# Altium schematic sheet Net.SchDoc
size A4
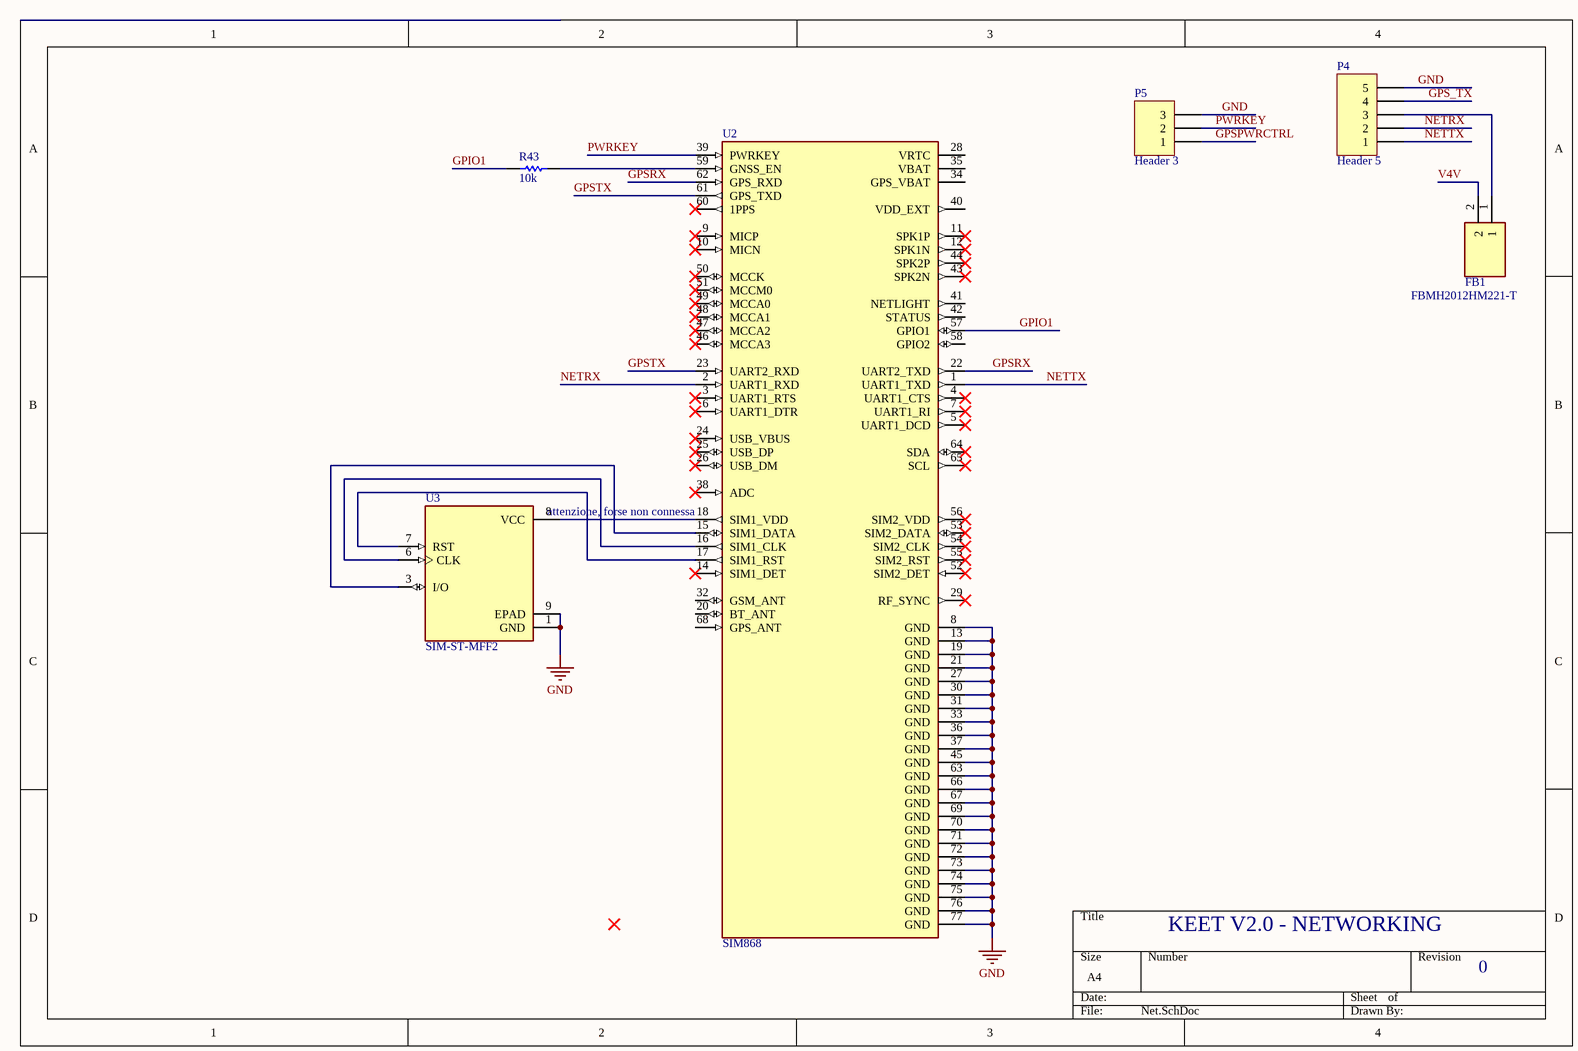
[diagram p0: Net.SchDoc]

## Parts
FB1  FBMH2012HM221-T  [BEADC2012X105N]
P4  Header 5  [HDR1X5]
P5  Header 3  [HDR1X3]
R43  10k  [RESC1005X04N]
U2  SIM868  [XCVR_SIM868]
U3  SIM-ST-MFF2  [PSON127P500X600X82-9N]

## Nets
GND: P4.5 P5.3 U2.8(GND) U2.13(GND) U2.19(GND) U2.21(GND) U2.27(GND) U2.30(GND) U2.31(GND) U2.33(GND) U2.36(GND) U2.37(GND) U2.45(GND) U2.63(GND) U2.66(GND) U2.67(GND) U2.69(GND) U2.70(GND) U2.71(GND) U2.72(GND) U2.73(GND) U2.74(GND) U2.75(GND) U2.76(GND) U2.77(GND) U3.1(GND) U3.9(EPAD)
GPIO1: R43.2 U2.57(GPIO1)
GPS_TX: P4.4
GPSPWRCTRL: P5.1
GPSRX: U2.22(UART2_TXD) U2.62(GPS_RXD)
GPSTX: U2.23(UART2_RXD) U2.61(GPS_TXD)
NETRX: P4.2 U2.2(UART1_RXD)
NETTX: P4.1 U2.1(UART1_TXD)
PWRKEY: P5.2 U2.39(PWRKEY)
V4V: FB1.2
NetFB1_1: FB1.1 P4.3
NetR43_1: R43.1 U2.59(GNSS_EN)
NetU2_15: U2.15(SIM1_DATA) U3.3(I/O)
NetU2_16: U2.16(SIM1_CLK) U3.6(CLK)
NetU2_17: U2.17(SIM1_RST) U3.7(RST)
NetU2_18: U2.18(SIM1_VDD) U3.8(VCC)

Not connected (* = marked no-connect by the designer): U2 3(UART1_RTS)* 4(UART1_CTS)* 5(UART1_DCD)* 6(UART1_DTR)* 7(UART1_RI)* 9(MICP)* 10(MICN)* 11(SPK1P)* 12(SPK1N)* 14(SIM1_DET)* 20(BT_ANT) 24(USB_VBUS)* 25(USB_DP)* 26(USB_DM)* 28(VRTC) 29(RF_SYNC)* 32(GSM_ANT) 34(GPS_VBAT) 35(VBAT) 38(ADC)* 40(VDD_EXT) 41(NETLIGHT) 42(STATUS) 43(SPK2N)* 44(SPK2P)* 46(MCCA3)* 47(MCCA2)* 48(MCCA1)* 49(MCCA0)* 50(MCCK)* 51(MCCM0)* 52(SIM2_DET)* 53(SIM2_DATA)* 54(SIM2_CLK)* 55(SIM2_RST)* 56(SIM2_VDD)* 58(GPIO2) 60(1PPS)* 64(SDA)* 65(SCL)* 68(GPS_ANT)

## Notes on the sheet
- (near U2) attenzione, forse non connessa
- KEET V2.0 - NETWORKING
- 0

## Library data of the parts
FB1 = FBMH2012HM221-T: Ferrite Bead; Manufacturer_Name: TAIYO YUDEN; Datasheet Link: http://ds.yuden.co.jp/TYCOMPAS/ut/detail.do?productNo=FBMH2012HM221-T&fileName=FBMH2012HM221-T_SS&mode=specSheetDownload; Height: 1.05mm; Manufacturer_Part_Number: FBMH2012HM221-T; Mouser Part Number: 963-FBMH2012HM221-T; Mouser Price/Stock: https://www.mouser.co.uk/ProductDetail/Taiyo-Yuden/FBMH2012HM221-T?qs=I6KAKw0tg2yIAV1HVl6Cew%3D%3D; Arrow Part Number: FBMH2012HM221-T; Arrow Price/Stock: https://www.arrow.com/en/products/fbmh2012hm221-t/taiyo-yuden
P4 = Header 5: Header, 5-Pin; LatestRevisionDate: 17-Jul-2002; LatestRevisionNote: Re-released for DXP Platform.; Publisher: Altium Limited
P5 = Header 3: Header, 3-Pin; LatestRevisionDate: 17-Jul-2002; LatestRevisionNote: Re-released for DXP Platform.; Publisher: Altium Limited
R43 = CRCW0402-10K0FKED: Res Thick Film 0402 10K Ohm 1% 1/16W ±100ppm/°C Molded SMD Paper T/R; Manufacturer: Vishay; Power Rating: 63mW; Resistance: 10kR; Voltage Rating: 50V; Supplier 1: Mouser; Manufacturer Part Number: CRCW0402-10K0FKED; RoHS: Yes; Category: Chip SMD Resistors; Stock 1: 1711719; Pricing 1: 1=0,100000, 10=0,033000, 50=0,033000, 100=0,014000, 1000=0,006000, 10000=0,005000 (USD); Mount: Surface Mount; Case/Package: 0402; Number of Pins: 2; Contact Plating: Tin; Weight: 2.3E-05oz; Case Code (Metric): 1005; Case Code (Imperial): 0402; Min Operating Temperature: -55°C; Max Operating Temperature: 155°C; Tolerance: 1%; Resistor Type: Thick Film; Temperature Coefficient: 100ppm/°C; Termination: SMD/SMT; Package Quantity: 10; Packaging: Tape and Reel; Number of Terminations: 2; Max Power Dissipation: 63mW; Voltage Rating (DC): 50V; Features: Automotive AEC-Q200; Length: 1mm; Width: 0.02inch; Height: 0.35mm; Depth: 0.5mm; Radiation Hardening: No; Lead Free: Lead Free; REACH SVHC: Unknown; Military Standard: Not; ComponentLink1URL: https://datasheet.ciiva.com/11809/0900766b80d98824-11809984.pdf?src-supplier=RSComponents; ComponentLink1Description: https://datasheet.ciiva.com/11809/0900766b80d98824-11809984.pdf?src-supplier=RSComponents; ComponentLink2URL: https://datasheet.ciiva.com/2463/dcrcwe3-2463025.pdf?src-supplier=Digi-Key; ComponentLink2Description: https://datasheet.ciiva.com/2463/dcrcwe3-2463025.pdf?src-supplier=Digi-Key; ComponentLink3URL: https://datasheet.ciiva.com/2463/dcrcwe3-2463026.pdf?src-supplier=Digi-Key; ComponentLink3Description: https://datasheet.ciiva.com/2463/dcrcwe3-2463026.pdf?src-supplier=Digi-Key; ComponentLink4URL: https://datasheet.ciiva.com/2463/dcrcwe3-2463027.pdf?src-supplier=Digi-Key; ComponentLink4Description: https://datasheet.ciiva.com/2463/dcrcwe3-2463027.pdf?src-supplier=Digi-Key; ComponentLink5URL: https://datasheet.ciiva.com/46385/1697337-46385560.pdf?src-supplier=Element14; ComponentLink5Description: https://datasheet.ciiva.com/46385/1697337-46385560.pdf?src-supplier=Element14; ComponentLink6URL: https://datasheet.ciiva.com/3255/dcrcwe3-3255961.pdf?src-supplier=Avnet; ComponentLink6Description: https://datasheet.ciiva.com/3255/dcrcwe3-3255961.pdf?src-supplier=Avnet; ComponentLink7URL: https://datasheet.ciiva.com/3255/dcrcwe3-3255962.pdf?src-supplier=Avnet; ComponentLink7Description: https://datasheet.ciiva.com/3255/dcrcwe3-3255962.pdf?src-supplier=Avnet; ComponentLink8URL: https://datasheet.ciiva.com/5547/dcrcwe3-109170-5547786.pdf?src-supplier=Mouser; ComponentLink8Description: https://datasheet.ciiva.com/5547/dcrcwe3-109170-5547786.pdf?src-supplier=Mouser; ComponentLink9URL: https://datasheet.ciiva.com/26316/fld-crcw-e3-data-en-26316618.pdf?src-supplier=Distrelec; ComponentLink9Description: https://datasheet.ciiva.com/26316/fld-crcw-e3-data-en-26316618.pdf?src-supplier=Distrelec; ComponentLink10URL: https://datasheet.ciiva.com/16208/dcrcwe3-16208525.pdf?src-supplier=Future+Electronics; ComponentLink10Description: https://datasheet.ciiva.com/16208/dcrcwe3-16208525.pdf?src-supplier=Future+Electronics; ComponentLink11URL: https://datasheet.ciiva.com/36856/1720486-36856909.pdf?src-supplier=Element14; ComponentLink11Description: https://datasheet.ciiva.com/36856/1720486-36856909.pdf?src-supplier=Element14; Supplier Part Number 1: 71-CRCW0402-10K-E3
U2 = SIM868: SIM868 GNSS, GSM RF mikroBUSâ„¢ Clickâ„¢ Platform Evaluation Expansion Board; MF: MikroElektronika; Availability: Unavailable; SnapEDA_Link: https://www.snapeda.com/parts/SIM868/MikroElektronika/view-part/598612/?ref=snap; Price: None; Package: None; MP: SIM868; Value: *
U3 = SIM-ST-MFF2: GLOBAL IOT EMBEDDED SIM CHIP; MF: Hologram, Inc.; SnapEDA_Link: https://www.snapeda.com/parts/SIM-ST-MFF2/Hologram%2C%20Inc./view-part/3075908/?ref=snap; MP: SIM-ST-MFF2; Availability: Unavailable; Price: None; Value: *; Package: None